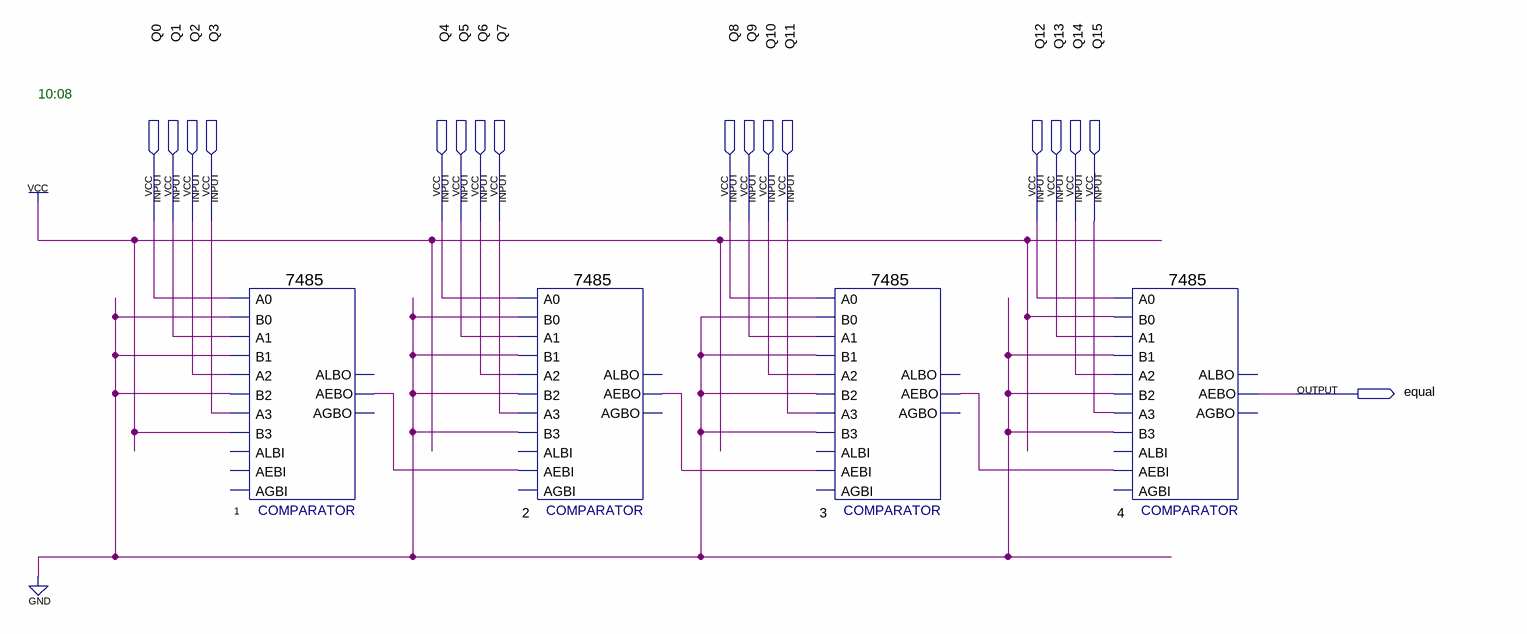
[diagram p0: schematic sheet]
// Quartus schematic 16bitCmp.bdf as structural Verilog: 4 symbols, 17 pins
module \16bitCmp  (
  input  Q0,
  input  Q1,
  input  Q2,
  input  Q3,
  input  Q4,
  input  Q5,
  input  Q6,
  input  Q7,
  input  Q8,
  input  Q9,
  input  Q10,
  input  Q11,
  input  Q12,
  input  Q13,
  input  Q14,
  input  Q15,
  output equal
);

  wire n1_aebo, n2_aebo, n3_aebo;

  \7485  u_1 (
    .A3(Q3), .B2(1'b0), .A2(Q2), .A0(Q0), .B0(1'b0), .B3(1'b1), .A1(Q1), .B1(1'b0), .AEBO(n1_aebo));  // open: AEBI, AGBI, ALBI, ALBO, AGBO
  \7485  u_2 (
    .A3(Q7), .B2(1'b0), .A2(Q6), .AEBI(n1_aebo), .A0(Q4), .B0(1'b0), .B3(1'b0), .A1(Q5), .B1(1'b0),
    .AEBO(n2_aebo));  // open: AGBI, ALBI, ALBO, AGBO
  \7485  u_3 (
    .A3(Q11), .B2(1'b0), .A2(Q10), .AEBI(n2_aebo), .A0(Q8), .B0(1'b0), .B3(1'b0), .A1(Q9), .B1(1'b0),
    .AEBO(n3_aebo));  // open: AGBI, ALBI, ALBO, AGBO
  \7485  u_4 (
    .A3(Q15), .B2(1'b0), .A2(Q14), .AEBI(n3_aebo), .A0(Q12), .B0(1'b1), .B3(1'b0), .A1(Q13), .B1(1'b0),
    .AEBO(equal));  // open: AGBI, ALBI, ALBO, AGBO

  // Notes on the sheet:
  //   10:08
endmodule
